# Altium schematic sheet McuSupply.SchDoc: Title
size A4; SchTemplateVer: V2.0; Author: Adam Mizerkiewicz; CompanyName: Adam Mizerkiewicz; DrawnBy: Adam Mizerkiewicz; Engineer: Adam Mizerkiewicz; Organization: Adam Mizerkiewicz; Address1: Sarnia 2/19; Address2: 61-058 Poznań; Revision: 0.0
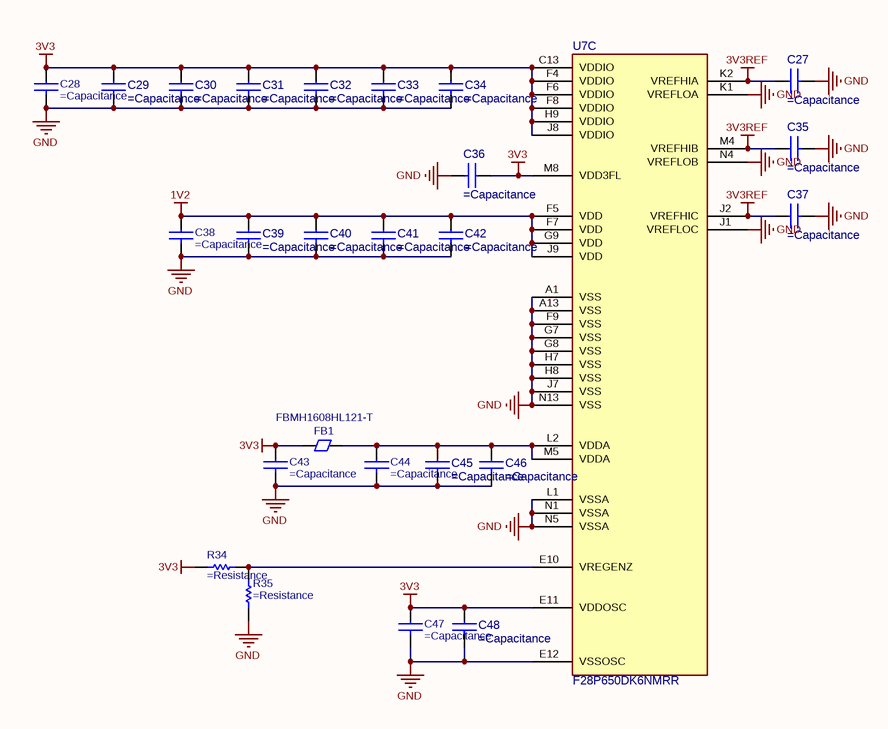
[diagram p0: McuSupply.SchDoc]

## Parts
C27  (no value)  [C0402]
C28  (no value)  [C0603]
C29  (no value)  [C0402]
C30  (no value)  [C0402]
C31  (no value)  [C0402]
C32  (no value)  [C0402]
C33  (no value)  [C0402]
C34  (no value)  [C0402]
C35  (no value)  [C0402]
C36  (no value)  [C0402]
C37  (no value)  [C0402]
C38  (no value)  [C0603]
C39  (no value)  [C0402]
C40  (no value)  [C0402]
C41  (no value)  [C0402]
C42  (no value)  [C0402]
C43  (no value)  [C0603]
C44  (no value)  [C0603]
C45  (no value)  [C0402]
C46  (no value)  [C0402]
C47  (no value)  [C0603]
C48  (no value)  [C0402]
FB1  FBMH1608HL121-T  [FB0603]
R34  (no value)  [R0402]
R35  (no value)  [R0402]
U7  F28P650DK6NMRR  [NFBGA169]  (part C of 3)

## Nets
1V2: C38.1 C39.1 C40.1 C41.1 C42.1 U7.F5(VDD) U7.F7(VDD) U7.G9(VDD) U7.J9(VDD)
3V3: C28.1 C29.1 C30.1 C31.1 C32.1 C33.1 C34.1 C36.1 C43.1 C47.1 C48.1 FB1.1 R34.2 U7.C13(VDDIO) U7.E11(VDDOSC) U7.F4(VDDIO) U7.F6(VDDIO) U7.F8(VDDIO) U7.H9(VDDIO) U7.J8(VDDIO) U7.M8(VDD3FL)
3V3REF: C27.1 C35.1 C37.1 U7.J2(VREFHIC) U7.K2(VREFHIA) U7.M4(VREFHIB)
GND: C27.2 C28.2 C29.2 C30.2 C31.2 C32.2 C33.2 C34.2 C35.2 C36.2 C37.2 C38.2 C39.2 C40.2 C41.2 C42.2 C43.2 C44.2 C45.2 C46.2 C47.2 C48.2 R35.1 U7.A1(VSS) U7.A13(VSS) U7.E12(VSSOSC) U7.F9(VSS) U7.G7(VSS) U7.G8(VSS) U7.H7(VSS) U7.H8(VSS) U7.J1(VREFLOC) U7.J7(VSS) U7.K1(VREFLOA) U7.L1(VSSA) U7.N1(VSSA) U7.N4(VREFLOB) U7.N5(VSSA) U7.N13(VSS)
NetC44_1: C44.1 C45.1 C46.1 FB1.2 U7.L2(VDDA) U7.M5(VDDA)
NetR34_1: R34.1 R35.2 U7.E10(VREGENZ)

## Notes on the sheet
- Revision
  =Revision
- Sheet
  =SheetNumber / =SheetTotal

## Library data of the parts
C27 C29-C37 C39-C42 C45 C46 C48 = CAP0402-0.1uF-50V: CAP CER 0.1UF 50V X7R 0402; Manufacturer: Walsin Technologies; Manufacturer Part Number: 0402B104K500CT; Capacitance: 100nF; Material: 4241ConductorMaterial; Value: 100nF; Tolerance: 10%; Dielectric: 1511DielectricType; Supplier: Digikey; Supplier Part Number: 1292-1176-1-ND; RoHS: Yes; Category: Ceramic Capacitors; Stock: 109567; Pricing: 1=0,08, 10=0,005, 100=0,0032, 1000=0,0024 (USD); Mounting Technology: Surface Mount; Case/Package: 0402; Case Code (Imperial): 0402; Case Code (Metric): 1005; Min Operating Temperature: -55°C; Max Operating Temperature: 125°C; Packaging: Cut Tape; Voltage Rating: 50V; Series: -; Voltage Rating (DC): 50V; Height: 550um; RoHS Compliant: Yes; Lead Free: 5697LeadFree; ComponentLink1URL: http://datasheet.octopart.com/0402B104K500CT-Walsin-Technologies-datasheet-26371553.pdf?src-supplier=Arrow+Electronics; ComponentLink1Description: http://datasheet.octopart.com/0402B104K500CT-Walsin-Technologies-datasheet-26371553.pdf?src-supplier=Arrow+Electronics; ComponentLink2URL: http://datasheet.octopart.com/0402B104K500CT-Walsin-Technologies-datasheet-26371553.pdf?src-supplier=Verical; ComponentLink2Description: http://datasheet.octopart.com/0402B104K500CT-Walsin-Technologies-datasheet-26371553.pdf?src-supplier=Verical; ComponentLink3URL: http://www.passivecomponent.com/indexsea/0402B104K500CT-IE.pdf?src-supplier=Digikey; ComponentLink3Description: http://www.passivecomponent.com/indexsea/0402B104K500CT-IE.pdf?src-supplier=Digikey; ComponentLink4URL: http://datasheet.octopart.com/0402B104K500CT-Walsin-Technologies-datasheet-26371553.pdf?src-supplier=Rs; ComponentLink4Description: http://datasheet.octopart.com/0402B104K500CT-Walsin-Technologies-datasheet-26371553.pdf?src-supplier=Rs; ComponentLink5URL: https://datasheet.octopart.com/0402B104K500CT-Walsin-Technologies-datasheet-128065749.pdf?src-supplier=Future+Electronics; ComponentLink5Description: https://datasheet.octopart.com/0402B104K500CT-Walsin-Technologies-datasheet-128065749.pdf?src-supplier=Future+Electronics; ComponentLink6URL: http://datasheet.octopart.com/0402B104K500CT-Walsin-Technologies-datasheet-26371553.pdf?src-supplier=Farnell; ComponentLink6Description: http://datasheet.octopart.com/0402B104K500CT-Walsin-Technologies-datasheet-26371553.pdf?src-supplier=Farnell; ComponentLink7URL: http://datasheet.octopart.com/0402B104K500CT-Walsin-Technologies-datasheet-26371553.pdf?src-supplier=Newark; ComponentLink7Description: http://datasheet.octopart.com/0402B104K500CT-Walsin-Technologies-datasheet-26371553.pdf?src-supplier=Newark; ComponentLink8URL: http://datasheet.octopart.com/0402B104K500CT-Walsin-Technologies-datasheet-26371553.pdf?src-supplier=Mouser; ComponentLink8Description: http://datasheet.octopart.com/0402B104K500CT-Walsin-Technologies-datasheet-26371553.pdf?src-supplier=Mouser; ComponentLink9URL: http://datasheet.octopart.com/0402B104K500CT-Walsin-Technologies-datasheet-26371553.pdf?src-supplier=Digikey; ComponentLink9Description: http://datasheet.octopart.com/0402B104K500CT-Walsin-Technologies-datasheet-26371553.pdf?src-supplier=Digikey; ComponentLink10URL: https://datasheet.octopart.com/0402B104K500CT-Walsin-Technologies-datasheet-62066062.pdf?src-supplier=TME; ComponentLink10Description: https://datasheet.octopart.com/0402B104K500CT-Walsin-Technologies-datasheet-62066062.pdf?src-supplier=TME; ComponentLink11URL: http://datasheet.octopart.com/0402B104K500CT-Walsin-Technologies-datasheet-26371553.pdf?src-supplier=Freelance+Electronics; ComponentLink11Description: http://datasheet.octopart.com/0402B104K500CT-Walsin-Technologies-datasheet-26371553.pdf?src-supplier=Freelance+Electronics; ComponentLink12URL: http://datasheet.octopart.com/0402B104K500CT-Walsin-Technologies-datasheet-26371553.pdf?src-supplier=Component+Sense; ComponentLink12Description: http://datasheet.octopart.com/0402B104K500CT-Walsin-Technologies-datasheet-26371553.pdf?src-supplier=Component+Sense; ComponentLink13URL: http://datasheet.octopart.com/0402B104K500CT-Walsin-Technologies-datasheet-26371553.pdf?src-supplier=NAC+Semi; ComponentLink13Description: http://datasheet.octopart.com/0402B104K500CT-Walsin-Technologies-datasheet-26371553.pdf?src-supplier=NAC+Semi; ComponentLink14URL: https://datasheet.octopart.com/0402B104K500CT-Walsin-Technologies-datasheet-136037192.pdf?src-supplier=TECHDesign; ComponentLink14Description: https://datasheet.octopart.com/0402B104K500CT-Walsin-Technologies-datasheet-136037192.pdf?src-supplier=TECHDesign; Supplier 1: Digikey; Supplier Part Number 1: 1292-1176-1-ND
C28 C38 C43 C44 C47 = CAP0603-10uF-10V: CAP CER 10UF 10V X7R 0603; Manufacturer: Murata; Manufacturer Part Number: GRM188Z71A106KA73D; Material: 4241ConductorMaterial; Tolerance: 10%; Capacitance: 10uF; Supplier: Digikey; Supplier Part Number: 490-GRM188Z71A106KA73DDKR-ND; RoHS: Yes; Category: Ceramic Capacitors; Pricing: 1=0,28, 10=0,166, 100=0,1065, 1000=0,07585 (USD); Case/Package: 345Case; Min Operating Temperature: -55°C; Max Operating Temperature: 125°C; Value: 10uF; Voltage Rating: 10V; Length: 1.6mm; Width: 800um; Height: 1mm; Thickness: 800um; RoHS Compliant: Yes; ComponentLink1URL: https://datasheet.octopart.com/GRM188Z71A106KA73D-Murata-datasheet-165579666.pdf?src-supplier=TME; ComponentLink1Description: https://datasheet.octopart.com/GRM188Z71A106KA73D-Murata-datasheet-165579666.pdf?src-supplier=TME; Supplier 1: Digikey; Supplier Part Number 1: 490-GRM188Z71A106KA73DDKR-ND
FB1 = FBMH1608HL121-T: FERRITE BEAD 120 OHM 0603 1LN; Manufacturer: Taiyo Yuden; Supplier: Digikey; Supplier Part Number: 587-1731-1-ND; Manufacturer Part Number: FBMH1608HL121-T; RoHS: Yes; Category: Ferrite Beads and Chips; Stock: 4210; Pricing: 1=0,17, 10=0,118, 25=0,1024, 50=0,0916, 100=0,082, 250=0,07028, 500=0,06222, 1000=0,05476 (USD); ComponentLink1URL: https://datasheet.ciiva.com/16001/104fbmh1608hl121-t-16001055.pdf?src-supplier=Onlinecomponents.com; ComponentLink1Description: https://datasheet.ciiva.com/16001/104fbmh1608hl121-t-16001055.pdf?src-supplier=Onlinecomponents.com; ComponentLink2URL: https://datasheet.ciiva.com/7966/fbmh1608hl121-t-ss-7966161.pdf?src-supplier=Element14; ComponentLink2Description: https://datasheet.ciiva.com/7966/fbmh1608hl121-t-ss-7966161.pdf?src-supplier=Element14; ComponentLink3URL: https://datasheet.ciiva.com/30209/fbmh1608hl121-t-30209463.pdf?src-supplier=Onlinecomponents.com; ComponentLink3Description: https://datasheet.ciiva.com/30209/fbmh1608hl121-t-30209463.pdf?src-supplier=Onlinecomponents.com; ComponentLink4URL: https://datasheet.ciiva.com/25612/0900766b810b37be-25612388.pdf?src-supplier=Rs; ComponentLink4Description: https://datasheet.ciiva.com/25612/0900766b810b37be-25612388.pdf?src-supplier=Rs; ComponentLink5URL: https://datasheet.ciiva.com/1012/chipbeads01-e-1012500.pdf?src-supplier=Digikey; ComponentLink5Description: https://datasheet.ciiva.com/1012/chipbeads01-e-1012500.pdf?src-supplier=Digikey; ComponentLink6URL: https://datasheet.ciiva.com/1012/chipbeads01-e-1012501.pdf?src-supplier=Digikey; ComponentLink6Description: https://datasheet.ciiva.com/1012/chipbeads01-e-1012501.pdf?src-supplier=Digikey; ComponentLink7URL: https://datasheet.ciiva.com/1012/chipbeads01-e-1012502.pdf?src-supplier=Digikey; ComponentLink7Description: https://datasheet.ciiva.com/1012/chipbeads01-e-1012502.pdf?src-supplier=Digikey; Supplier 1: Digikey; Supplier Part Number 1: 587-1731-1-ND
R34 R35 = RES0402-10k-1%: Res Thick Film 0402 10K Ohm 1% 0.063W(1/16W) ±100ppm/C Pad SMD T/R Automotive AEC-Q200; Manufacturer: Vishay; Manufacturer Part Number: CRCW040210K0FKEE; Resistance: 10kΩ; Max Power Dissipation: 63mW; Value: 10kΩ; Temperature Coefficient: 100ppm/°C; Voltage Rating: 50V; Supplier 1: DigiKey; Supplier Part Number 1: 541-2954-1-ND; Supplier: DigiKey; Supplier Part Number: 541-2954-1-ND; RoHS: Compliant; Category: Chip SMD Resistors; Pricing: 1=0,1, 10=0,03, 25=0,0224, 50=0,018, 100=0,0148, 250=0,01156, 500=0,00974, 1000=0,00832, 5000=0,00637 (USD); Case/Package: 0402; Case Code (Imperial): 0402; Case Code (Metric): 1005; China RoHS: Non-Compliant; Composition: Thick Film; Contact Plating: Tin; Depth: 500µm; Features: Automotive AEC-Q200; Height: 350µm; Lead Free: Lead Free; Length: 990.6µm; Lifecycle Status: Production; Max Operating Temperature: 155°C; Military Standard: Not; Min Operating Temperature: -55°C; Mounting Technology: Surface Mount; Number of Terminals: 2; Number of Terminations: 2; Packaging: Tape & Reel; Power Dissipation: 63mW; Power Rating: 63mW; Radiation Hardening: No; REACH SVHC: Yes; Schedule B: 8533210045, 8533210045|8533210045|8533210045|8533210045|8533210045|8533210045|8533210045|8533210045|8533210045|8533210045|8533210045|8533210045|8533210045|8533210045|8533210045|8533210045|8533210045|8533210045|8533210045|8533210045|8533210045|8533210045|8533210045|85; Tolerance: 1%; Voltage Rating (DC): 50V; Width: 500µm; Working Voltage: 50V; ComponentLink1URL: https://datasheet.octopart.com:443/CRCW040210K0FKEE-Vishay-datasheet-175423584.pdf?src-supplier=IHS; ComponentLink1Description: https://datasheet.octopart.com:443/CRCW040210K0FKEE-Vishay-datasheet-175423584.pdf?src-supplier=IHS; ComponentLink2URL: https://datasheet.octopart.com:443/CRCW040210K0FKEE-Vishay-datasheet-62316122.pdf?src-supplier=Future+Electronics; ComponentLink2Description: https://datasheet.octopart.com:443/CRCW040210K0FKEE-Vishay-datasheet-62316122.pdf?src-supplier=Future+Electronics; ComponentLink3URL: http://sigma.octopart.com:80/rohs_statement/Vishay-company-15.pdf?src-supplier=Compliance+Statements; ComponentLink3Description: http://sigma.octopart.com:80/rohs_statement/Vishay-company-15.pdf?src-supplier=Compliance+Statements
U7 = F28P650DK6NMRR_1: C2000™ 32-bit MCU, 2x C28x+CLA CPU, Lock Step, 1.28-MB flash, 16-b ADC, HRPWM, EtherCAT, CAN-FD, AES 169-NFBGA -40 to...; Manufacturer: Texas Instruments; Manufacturer Lifecycle Status: ACTIVE; Number of UART Channels: 4; Supplier 1: DigiKey; Supplier Part Number 1: 296-F28P650DK6NMRRTR-ND; Supplier: DigiKey; Supplier Part Number: 296-F28P650DK6NMRRTR-ND; Manufacturer Part Number: F28P650DK6NMRR; RoHS: Compliant; Category: Microcontrollers; Pricing: 1000=11,46098 (USD); Height: 0m; Length: 9mm; Lifecycle Status: Production; Pins: 169; Thickness: 650µm; Width: 9mm; ComponentLink1URL: https://sigma.octopart.com:443/170336436/technical_drawing/Texas-Instruments-F28P650DK6NMRR.pdf?src-supplier=Texas+Instruments; ComponentLink1Description: https://sigma.octopart.com:443/170336436/technical_drawing/Texas-Instruments-F28P650DK6NMRR.pdf?src-supplier=Texas+Instruments; ComponentLink2URL: https://octopart.com:443/opatz8j6/c1?t=APRw11tpYPVjWCcH60awOXt0cGwImscANGC7li7_cx_Agxm915MhAZTObmDghc9eZOaw_mHD48OCZSRp73lGddKWUBe5fw7JdS3oY6-WaShYciiLLEgoA4x4huAl_qcDmd35tthWJciG_j9G0_KiT0SpOlZap5xOApFweMh2aZbGRedpPOVXVEDON4Icb6hkm9W7qm4-y49tBp6shpQILr3wInC47Ns5REcOk_fqp6GFBCGfdNNlvimY7LhF-z2TQJYRCUXuPMF8jbjKwibXb4IEVHm3troRaaxBm4vGhw5rMNpdyp6Yfknc0rFnvpyRKpgralAt9vXUJ0VNHXN8-zHJova3rwODBasGVAO6XlgY1J4nqzjFJr64ola8gSl7fMvjJfjBTM6KoBMDgg&src-supplier=Texas+Instruments; ComponentLink2Description: https://octopart.com:443/opatz8j6/c1?t=APRw11tpYPVjWCcH60awOXt0cGwImscANGC7li7_cx_Agxm915MhAZTObmDghc9eZOaw_mHD48OCZSRp73lGddKWUBe5fw7JdS3oY6-WaShYciiLLEgoA4x4huAl_qcDmd35tthWJciG_j9G0_KiT0SpOlZap5xOApFweMh2aZbGRedpPOVXVEDON4Icb6hkm9W7qm4-y49tBp6shpQILr3wInC47Ns5REcOk_fqp6GFBCGfdNNlvimY7LhF-z2TQJYRCUXuPMF8jbjKwibXb4IEVHm3troRaaxBm4vGhw5rMNpdyp6Yfknc0rFnvpyRKpgralAt9vXUJ0VNHXN8-zHJova3rwODBasGVAO6XlgY1J4nqzjFJr64ola8gSl7fMvjJfjBTM6KoBMDgg&src-supplier=Texas+Instruments; ComponentLink3URL: http://sigma.octopart.com:80/reach_statement/Texas-Instruments-company-64.pdf?src-supplier=Compliance+Statements; ComponentLink3Description: http://sigma.octopart.com:80/reach_statement/Texas-Instruments-company-64.pdf?src-supplier=Compliance+Statements; ComponentLink4URL: http://sigma.octopart.com:80/conflict_mineral_statement/Texas-Instruments-company-63.pdf?src-supplier=Compliance+Statements; ComponentLink4Description: http://sigma.octopart.com:80/conflict_mineral_statement/Texas-Instruments-company-63.pdf?src-supplier=Compliance+Statements